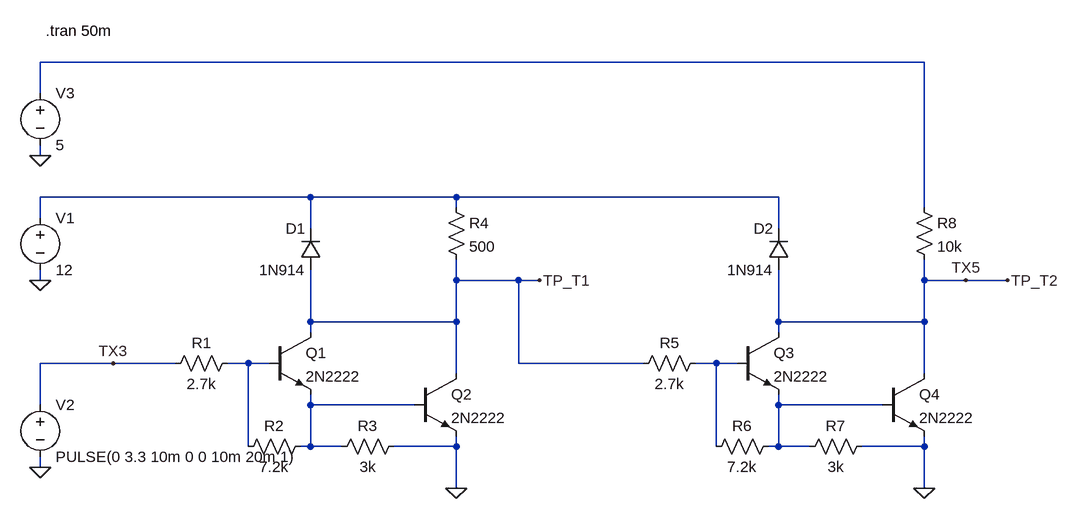
[diagram p0: schematic 4020 Control 2.asc]
4020 Control 2.asc, the LTspice schematic file:
Version 4
SHEET 1 1260 680
WIRE 1040 -288 -320 -288
WIRE -320 -240 -320 -288
WIRE -320 -144 -320 -160
WIRE 96 -80 -320 -80
WIRE 320 -80 96 -80
WIRE 816 -80 320 -80
WIRE 320 -64 320 -80
WIRE 1040 -64 1040 -288
WIRE -320 -48 -320 -80
WIRE 96 -32 96 -80
WIRE 816 -32 816 -80
WIRE -320 48 -320 32
WIRE 320 48 320 16
WIRE 416 48 320 48
WIRE 448 48 416 48
WIRE 1040 48 1040 16
WIRE 1104 48 1040 48
WIRE 1168 48 1104 48
WIRE 96 112 96 32
WIRE 320 112 320 48
WIRE 320 112 96 112
WIRE 816 112 816 32
WIRE 1040 112 1040 48
WIRE 1040 112 816 112
WIRE 96 128 96 112
WIRE 816 128 816 112
WIRE -208 176 -320 176
WIRE -112 176 -208 176
WIRE 0 176 -32 176
WIRE 32 176 0 176
WIRE 416 176 416 48
WIRE 608 176 416 176
WIRE 720 176 688 176
WIRE 752 176 720 176
WIRE 320 192 320 112
WIRE 1040 192 1040 112
WIRE -320 240 -320 176
WIRE 96 240 96 224
WIRE 256 240 96 240
WIRE 816 240 816 224
WIRE 976 240 816 240
WIRE 0 304 0 176
WIRE 96 304 96 240
WIRE 96 304 80 304
WIRE 144 304 96 304
WIRE 320 304 320 288
WIRE 320 304 224 304
WIRE 720 304 720 176
WIRE 816 304 816 240
WIRE 816 304 800 304
WIRE 864 304 816 304
WIRE 1040 304 1040 288
WIRE 1040 304 944 304
WIRE -320 336 -320 320
WIRE 320 368 320 304
WIRE 1040 368 1040 304
FLAG 320 368 0
FLAG -320 48 0
FLAG -320 336 0
FLAG -320 -144 0
FLAG 448 48 TP_T1
FLAG 1040 368 0
FLAG 1168 48 TP_T2
FLAG -208 176 TX3
FLAG 1104 48 TX5
SYMBOL npn 32 128 R0
SYMATTR InstName Q1
SYMATTR Value 2N2222
SYMBOL npn 256 192 R0
SYMATTR InstName Q2
SYMATTR Value 2N2222
SYMBOL res -16 160 R90
WINDOW 0 0 56 VBottom 2
WINDOW 3 32 56 VTop 2
SYMATTR InstName R1
SYMATTR Value 2.7k
SYMBOL res 96 288 R90
WINDOW 0 0 56 VBottom 2
WINDOW 3 32 56 VTop 2
SYMATTR InstName R2
SYMATTR Value 7.2k
SYMBOL res 240 288 R90
WINDOW 0 0 56 VBottom 2
WINDOW 3 32 56 VTop 2
SYMATTR InstName R3
SYMATTR Value 3k
SYMBOL voltage -320 -64 R0
WINDOW 123 0 0 Left 0
WINDOW 39 0 0 Left 0
SYMATTR InstName V1
SYMATTR Value 12
SYMBOL voltage -320 224 R0
WINDOW 123 0 0 Left 0
WINDOW 39 0 0 Left 0
SYMATTR InstName V2
SYMATTR Value PULSE(0 3.3 10m 0 0 10m 20m 1)
SYMBOL diode 112 32 R180
WINDOW 0 24 64 Left 2
WINDOW 3 24 0 Left 2
SYMATTR InstName D1
SYMATTR Value 1N914
SYMBOL res 304 -80 R0
SYMATTR InstName R4
SYMATTR Value 500
SYMBOL voltage -320 -256 R0
WINDOW 123 0 0 Left 0
WINDOW 39 0 0 Left 0
SYMATTR InstName V3
SYMATTR Value 5
SYMBOL npn 752 128 R0
SYMATTR InstName Q3
SYMATTR Value 2N2222
SYMBOL npn 976 192 R0
SYMATTR InstName Q4
SYMATTR Value 2N2222
SYMBOL res 704 160 R90
WINDOW 0 0 56 VBottom 2
WINDOW 3 32 56 VTop 2
SYMATTR InstName R5
SYMATTR Value 2.7k
SYMBOL res 816 288 R90
WINDOW 0 0 56 VBottom 2
WINDOW 3 32 56 VTop 2
SYMATTR InstName R6
SYMATTR Value 7.2k
SYMBOL res 960 288 R90
WINDOW 0 0 56 VBottom 2
WINDOW 3 32 56 VTop 2
SYMATTR InstName R7
SYMATTR Value 3k
SYMBOL diode 832 32 R180
WINDOW 0 24 64 Left 2
WINDOW 3 24 0 Left 2
SYMATTR InstName D2
SYMATTR Value 1N914
SYMBOL res 1024 -80 R0
SYMATTR InstName R8
SYMATTR Value 10k
TEXT -312 -336 Left 2 !.tran 50m

The netlist it stands for:
* 4020 Control 2.asc
Q1 TP_T1 N003 N005 0 2N2222
Q2 TP_T1 N005 0 0 2N2222
R1 N003 TX3 2.7k
R2 N005 N003 7.2k
R3 0 N005 3k
V1 N002 0 12
V2 TX3 0 PULSE(0 3.3 10m 0 0 10m 20m 1)
D1 TP_T1 N002 1N914
R4 N002 TP_T1 500
V3 N001 0 5
Q3 TX5 N004 N006 0 2N2222
Q4 TX5 N006 0 0 2N2222
R5 N004 TP_T1 2.7k
R6 N006 N004 7.2k
R7 0 N006 3k
D2 TX5 N002 1N914
R8 N001 TX5 10k
.model D D
.lib standard.dio
.model NPN NPN
.model PNP PNP
.lib standard.bjt
.tran 50m
.backanno
.end